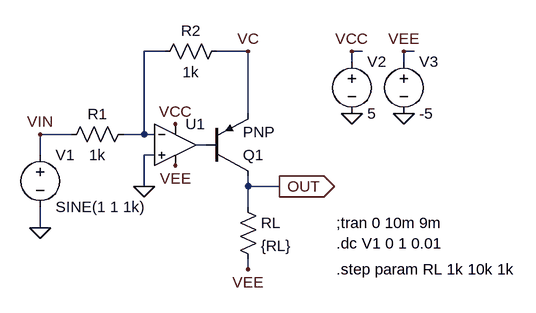
[diagram p0: schematic V-I Convert PNP.asc]
V-I Convert PNP.asc, the LTspice schematic file:
Version 4
SHEET 1 940 680
WIRE 288 -32 256 -32
WIRE 416 -32 368 -32
WIRE 592 -32 576 -32
WIRE 672 -32 656 -32
WIRE 576 -16 576 -32
WIRE 656 -16 656 -32
WIRE 416 64 416 -32
WIRE 144 96 96 96
WIRE 256 96 256 -32
WIRE 256 96 224 96
WIRE 272 96 256 96
WIRE 352 112 336 112
WIRE 96 128 96 96
WIRE 272 128 256 128
WIRE 256 176 256 128
WIRE 416 176 416 160
WIRE 464 176 416 176
WIRE 416 208 416 176
WIRE 96 240 96 208
WIRE 416 304 416 288
FLAG 96 240 0
FLAG 256 176 0
FLAG 304 80 VCC
FLAG 304 144 VEE
FLAG 576 64 0
FLAG 656 64 0
FLAG 576 -32 VCC
FLAG 656 -32 VEE
FLAG 416 304 VEE
FLAG 464 176 OUT
IOPIN 464 176 Out
FLAG 416 -32 VC
FLAG 96 96 VIN
SYMBOL voltage 96 112 R0
WINDOW 123 0 0 Left 2
WINDOW 39 0 0 Left 2
SYMATTR InstName V1
SYMATTR Value SINE(1 1 1k)
SYMBOL res 240 80 R90
WINDOW 0 0 56 VBottom 2
WINDOW 3 32 56 VTop 2
SYMATTR InstName R1
SYMATTR Value 1k
SYMBOL Opamps\\UniversalOpamp2 304 112 R0
SYMATTR InstName U1
SYMBOL res 384 -48 R90
WINDOW 0 0 56 VBottom 2
WINDOW 3 32 56 VTop 2
SYMATTR InstName R2
SYMATTR Value 1k
SYMBOL pnp 352 160 M180
SYMATTR InstName Q1
SYMBOL res 400 192 R0
SYMATTR InstName RL
SYMATTR Value {RL}
SYMBOL voltage 576 -32 R0
WINDOW 123 0 0 Left 2
WINDOW 39 0 0 Left 2
SYMATTR InstName V2
SYMATTR Value 5
SYMBOL voltage 656 -32 R0
WINDOW 123 0 0 Left 2
WINDOW 39 0 0 Left 2
SYMATTR InstName V3
SYMATTR Value -5
TEXT 552 232 Left 2 !;tran 0 10m 9m
TEXT 552 264 Left 2 !.dc V1 0 1 0.01
TEXT 552 304 Left 2 !.step param RL 1k 10k 1k

The netlist it stands for:
* V-I Convert PNP.asc
V1 VIN 0 SINE(1 1 1k)
R1 N001 VIN 1k
XU1 0 N001 VCC VEE N002 level.2 Avol=1Meg GBW=10Meg Slew=10Meg ilimit=25m rail=0 Vos=0 phimargin=45 en=0 enk=0 in=0 ink=0 Rin=500Meg  ; pins IN+ IN- V+ V- OUT
R2 VC N001 1k
Q1 OUT N002 VC 0 PNP
RL OUT VEE {RL}
V2 VCC 0 5
V3 VEE 0 -5
.model NPN NPN
.model PNP PNP
.lib standard.bjt
;tran 0 10m 9m
.dc V1 0 1 0.01
.step param RL 1k 10k 1k
.lib UniversalOpamps2.sub
.backanno
.end